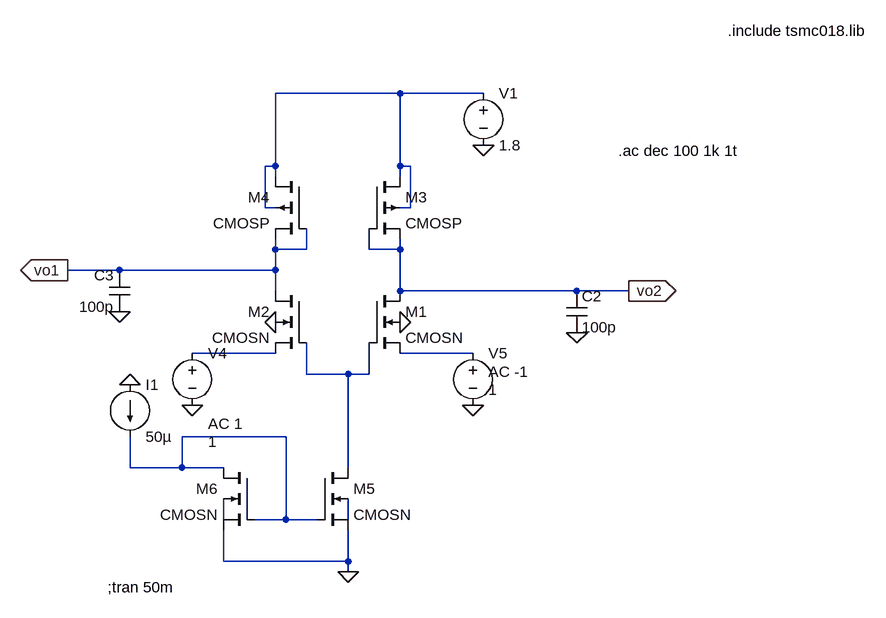
[diagram p0: schematic Draft1.asc]
Draft1.asc, the LTspice schematic file:
Version 4
SHEET 1 1004 680
WIRE 240 -160 48 -160
WIRE 368 -160 240 -160
WIRE 48 -48 48 -160
WIRE 48 -48 32 -48
WIRE 240 -48 240 -160
WIRE 256 -48 240 -48
WIRE 48 -32 48 -48
WIRE 240 -32 240 -48
WIRE 32 16 32 -48
WIRE 48 16 32 16
WIRE 256 16 256 -48
WIRE 256 16 240 16
WIRE 48 80 48 64
WIRE 96 80 96 48
WIRE 96 80 48 80
WIRE 192 80 192 48
WIRE 240 80 240 64
WIRE 240 80 192 80
WIRE -192 112 -272 112
WIRE 48 112 48 80
WIRE 48 112 -192 112
WIRE 48 144 48 112
WIRE 240 144 240 80
WIRE 512 144 240 144
WIRE 592 144 512 144
WIRE 48 240 -80 240
WIRE 352 240 240 240
WIRE 96 272 96 224
WIRE 160 272 96 272
WIRE 192 272 192 224
WIRE 192 272 160 272
WIRE 64 368 -96 368
WIRE -176 416 -176 368
WIRE -96 416 -96 368
WIRE -96 416 -176 416
WIRE -32 416 -96 416
WIRE 160 416 160 272
WIRE -32 496 -32 464
WIRE 64 496 64 368
WIRE 64 496 16 496
WIRE 112 496 64 496
WIRE 160 496 160 464
WIRE -32 560 -32 512
WIRE 160 560 160 512
WIRE 160 560 -32 560
WIRE 160 576 160 560
FLAG 160 576 0
FLAG 240 192 0
FLAG 48 192 0
FLAG 368 -80 0
FLAG -80 320 0
FLAG 352 320 0
FLAG -176 288 0
FLAG 592 144 vo2
IOPIN 592 144 Out
FLAG 512 208 0
FLAG -272 112 vo1
IOPIN -272 112 Out
FLAG -192 176 0
SYMBOL cmosn 192 144 R0
SYMATTR InstName M1
SYMATTR Value2 l=180n w=360n
SYMBOL cmosn 96 144 M0
SYMATTR InstName M2
SYMATTR Value2 l=180n w=360n
SYMBOL cmosn 112 416 R0
SYMATTR InstName M5
SYMATTR Value2 l=180n w=480n
SYMBOL voltage 368 -176 R0
WINDOW 123 0 0 Left 2
WINDOW 39 0 0 Left 2
SYMATTR InstName V1
SYMATTR Value 1.8
SYMBOL voltage -80 224 R0
WINDOW 3 24 152 Left 2
WINDOW 123 24 124 Left 2
WINDOW 39 0 0 Left 2
SYMATTR InstName V4
SYMATTR Value 1
SYMATTR Value2 AC 1
SYMBOL voltage 352 224 R0
WINDOW 3 24 72 Left 2
WINDOW 123 24 44 Left 2
WINDOW 39 0 0 Left 2
SYMATTR InstName V5
SYMATTR Value 1
SYMATTR Value2 AC -1
SYMBOL cmosp 192 -32 R0
SYMATTR InstName M3
SYMATTR Value2 l=180n w=360n
SYMBOL cmosp 96 -32 M0
SYMATTR InstName M4
SYMATTR Value2 l=180n w=360n
SYMBOL cmosn 16 416 M0
SYMATTR InstName M6
SYMATTR Value2 l=180n w=360n
SYMBOL current -176 288 R0
WINDOW 123 0 0 Left 2
WINDOW 39 0 0 Left 2
SYMATTR InstName I1
SYMATTR Value 50µ
SYMBOL cap 496 144 R0
SYMATTR InstName C2
SYMATTR Value 100p
SYMBOL cap -176 176 R180
WINDOW 0 24 56 Left 2
WINDOW 3 24 8 Left 2
SYMATTR InstName C3
SYMATTR Value 100p
TEXT 744 -256 Left 2 !.include tsmc018.lib
TEXT -210 600 Left 2 !;tran 50m
TEXT 576 -72 Left 2 !.ac dec 100 1k 1t

The netlist it stands for:
* Draft1.asc
M1 vo2 N004 N003 0 CMOSN l=180n w=360n
M2 vo1 N004 N002 0 CMOSN l=180n w=360n
M5 N004 N005 0 N007 CMOSN l=180n w=480n
V1 N001 0 1.8
V4 N002 0 1 AC 1
V5 N003 0 1 AC -1
M3 N001 vo2 vo2 N001 CMOSP l=180n w=360n
M4 N001 vo1 vo1 N001 CMOSP l=180n w=360n
M6 N005 N005 0 N006 CMOSN l=180n w=360n
I1 0 N005 50µ
C2 vo2 0 100p
C3 0 vo1 100p
.model NMOS NMOS
.model PMOS PMOS
.lib standard.mos
.include tsmc018.lib
;tran 50m
.ac dec 100 1k 1t
.backanno
.end